# EAGLE schematic WiazkaPrzerywacz (EAGLE 7.7.0)
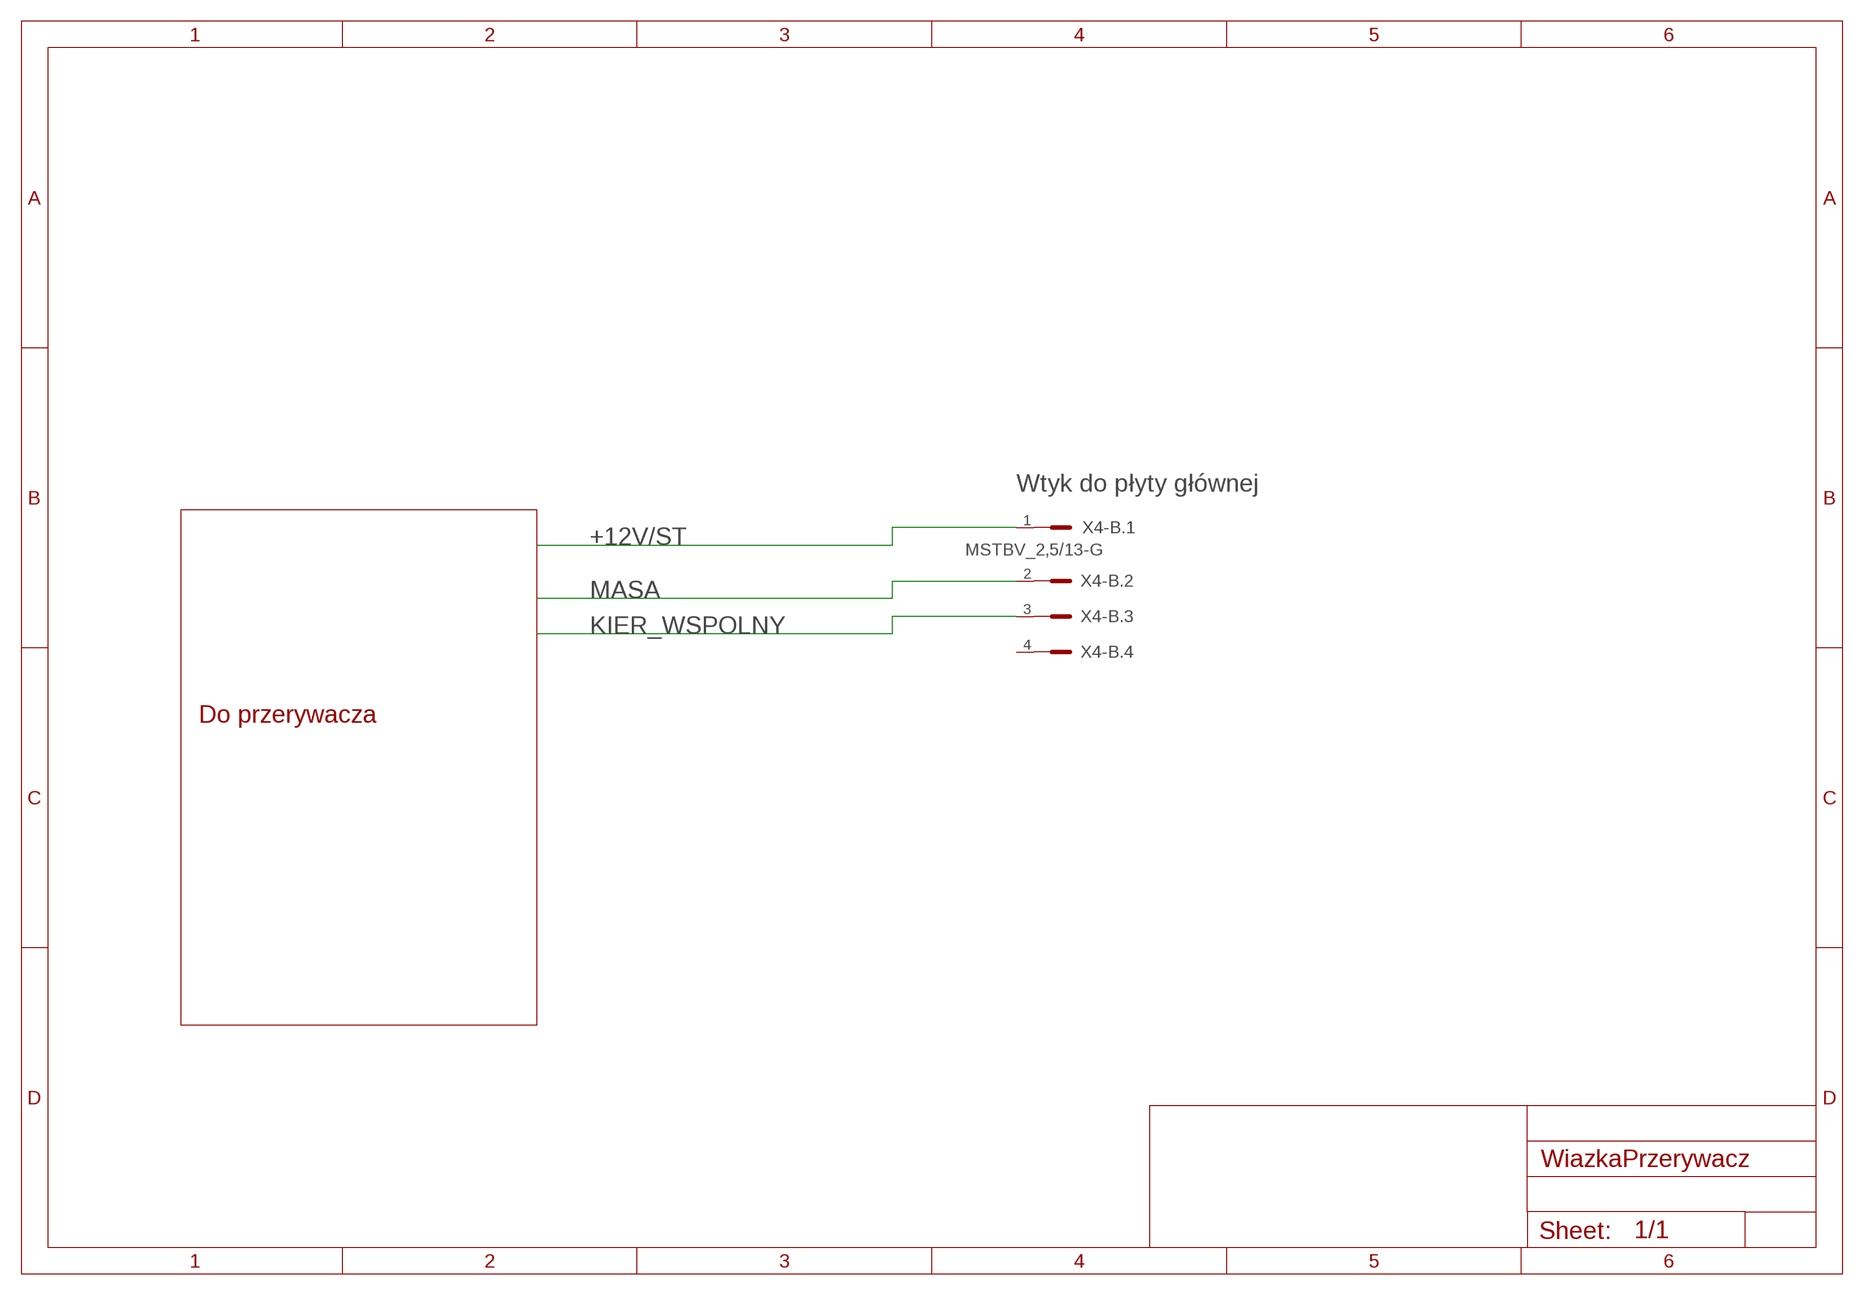
[diagram p0: schematic, sheet 1]

## Parts
X4-B  MSTBV_2,5/13-G  [MSTBV_2,5/13-G]

## Nets
+12V/ST: X4-B.1
KIER_WSPOLNY: X4-B.3
MASA: X4-B.2
Unconnected: X4-B.4 X4-B.5 X4-B.6 X4-B.7 X4-B.8 X4-B.9 X4-B.10 X4-B.11 X4-B.12 X4-B.13

## Notes on the sheet
- Wtyk do płyty głównej
- Do przerywacza

## Library data of the parts
X4-B = con-phoenix-500:MSTBV_2,5/13-G: Grundleiste - MSTBV 2,5/13-G - 1753657 Grundgehäuse, Nennstrom: 12 A Bemessungsspannung (III/2): 320 V Polzahl: 13 Rastermaß: 5 mm Farbe: grün Kontaktoberfläche: Zinn Montage: Löten